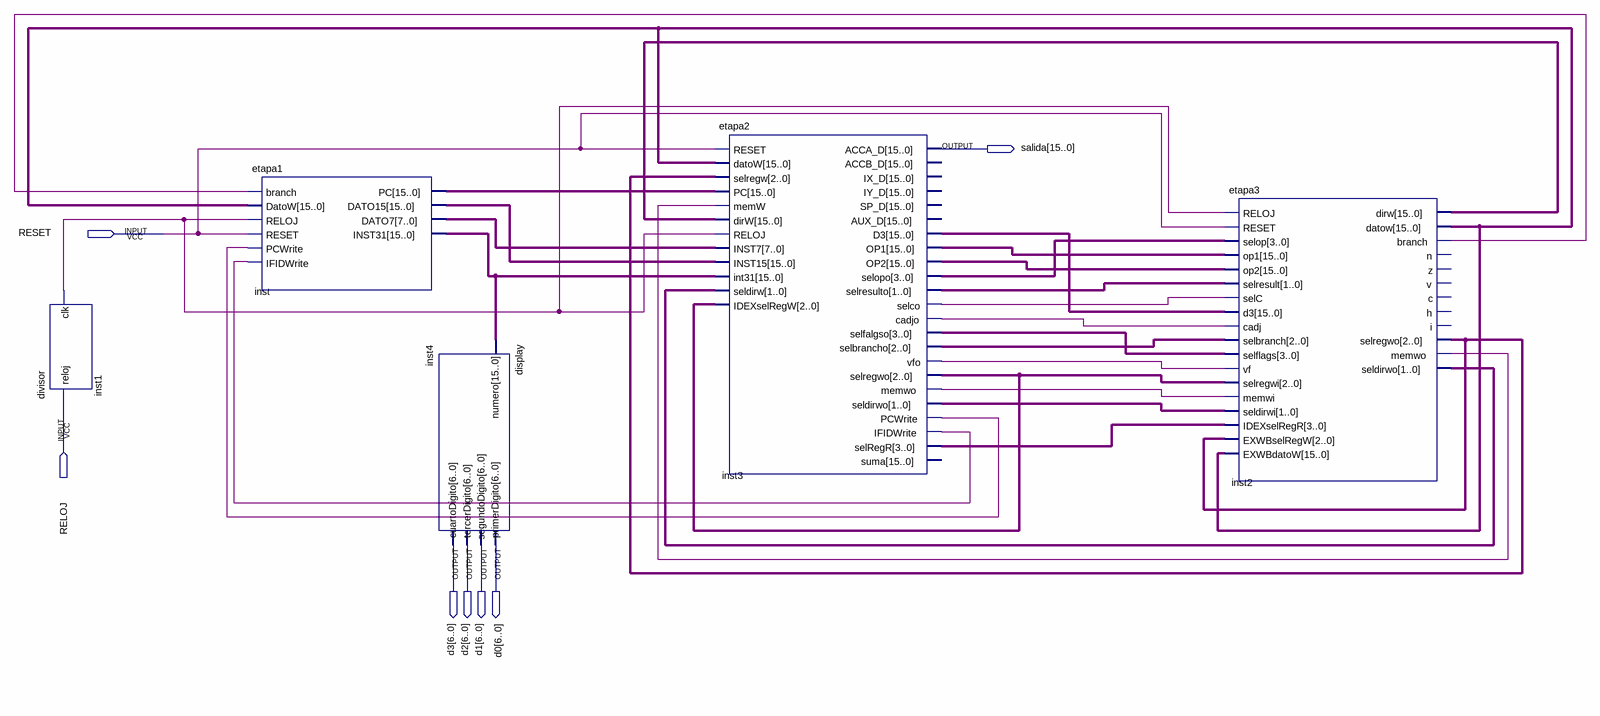
[diagram p0: schematic sheet]
// Quartus schematic pipeline.bdf as structural Verilog: 5 symbols, 7 pins
module pipeline (
  input  RESET,
  input  RELOJ,
  output [15:0] salida,
  output [6:0] d3,
  output [6:0] d2,
  output [6:0] d1,
  output [6:0] d0
);

  wire inst1_clk, inst2_branch, inst2_memwo, inst3_cadjo, inst3_ifidwrite, inst3_memwo, inst3_pcwrite,
       inst3_selco, inst3_vfo;
  wire [1:0] inst2_seldirwo, inst3_seldirwo, inst3_selresulto;
  wire [2:0] inst2_selregwo, inst3_selbrancho, inst3_selregwo;
  wire [3:0] inst3_selfalgso, inst3_selopo, inst3_selregr;
  wire [7:0] inst_dato7;
  wire [15:0] inst2_datow, inst2_dirw, inst3_d3, inst3_op1, inst3_op2, inst_dato15, inst_inst31, inst_pc;

  divisor inst1 (.reloj(RELOJ), .clk(inst1_clk));
  etapa1 inst (
    .branch(inst2_branch), .DatoW(inst2_datow), .IFIDWrite(inst3_ifidwrite), .RELOJ(inst1_clk),
    .RESET(RESET), .PCWrite(inst3_pcwrite), .PC(inst_pc), .DATO15(inst_dato15), .DATO7(inst_dato7),
    .INST31(inst_inst31));
  display inst4 (.numero(inst_inst31), .primerDigito(d0), .segundoDigito(d1), .tercerDigito(d2), .cuartoDigito(d3));
  etapa2 inst3 (
    .RESET(RESET), .datoW(inst2_datow), .selregw(inst2_selregwo), .PC(inst_pc), .memW(inst2_memwo),
    .dirW(inst2_dirw), .RELOJ(inst1_clk), .IDEXselRegW(inst3_selregwo), .INST7(inst_dato7),
    .INST15(inst_dato15), .int31(inst_inst31), .seldirw(inst2_seldirwo), .selRegR(inst3_selregr),
    .ACCA_D(salida), .D3(inst3_d3), .PCWrite(inst3_pcwrite), .OP1(inst3_op1), .IFIDWrite(inst3_ifidwrite),
    .OP2(inst3_op2), .selopo(inst3_selopo), .selresulto(inst3_selresulto), .selco(inst3_selco),
    .cadjo(inst3_cadjo), .selfalgso(inst3_selfalgso), .selbrancho(inst3_selbrancho), .vfo(inst3_vfo),
    .selregwo(inst3_selregwo), .memwo(inst3_memwo), .seldirwo(inst3_seldirwo));  // open: ACCB_D, IX_D, IY_D, SP_D, AUX_D, suma
  etapa3 inst2 (
    .op1(inst3_op1), .EXWBdatoW(inst2_datow), .RELOJ(inst1_clk), .RESET(RESET), .selop(inst3_selopo),
    .op2(inst3_op2), .selresult(inst3_selresulto), .selC(inst3_selco), .d3(inst3_d3), .cadj(inst3_cadjo),
    .IDEXselRegR(inst3_selregr), .EXWBselRegW(inst2_selregwo), .selbranch(inst3_selbrancho),
    .selflags(inst3_selfalgso), .vf(inst3_vfo), .selregwi(inst3_selregwo), .memwi(inst3_memwo),
    .seldirwi(inst3_seldirwo), .dirw(inst2_dirw), .datow(inst2_datow), .branch(inst2_branch),
    .selregwo(inst2_selregwo), .memwo(inst2_memwo), .seldirwo(inst2_seldirwo));  // open: n, z, v, c, h, i
endmodule
